# EAGLE design pcb (EAGLE 9.6.2)
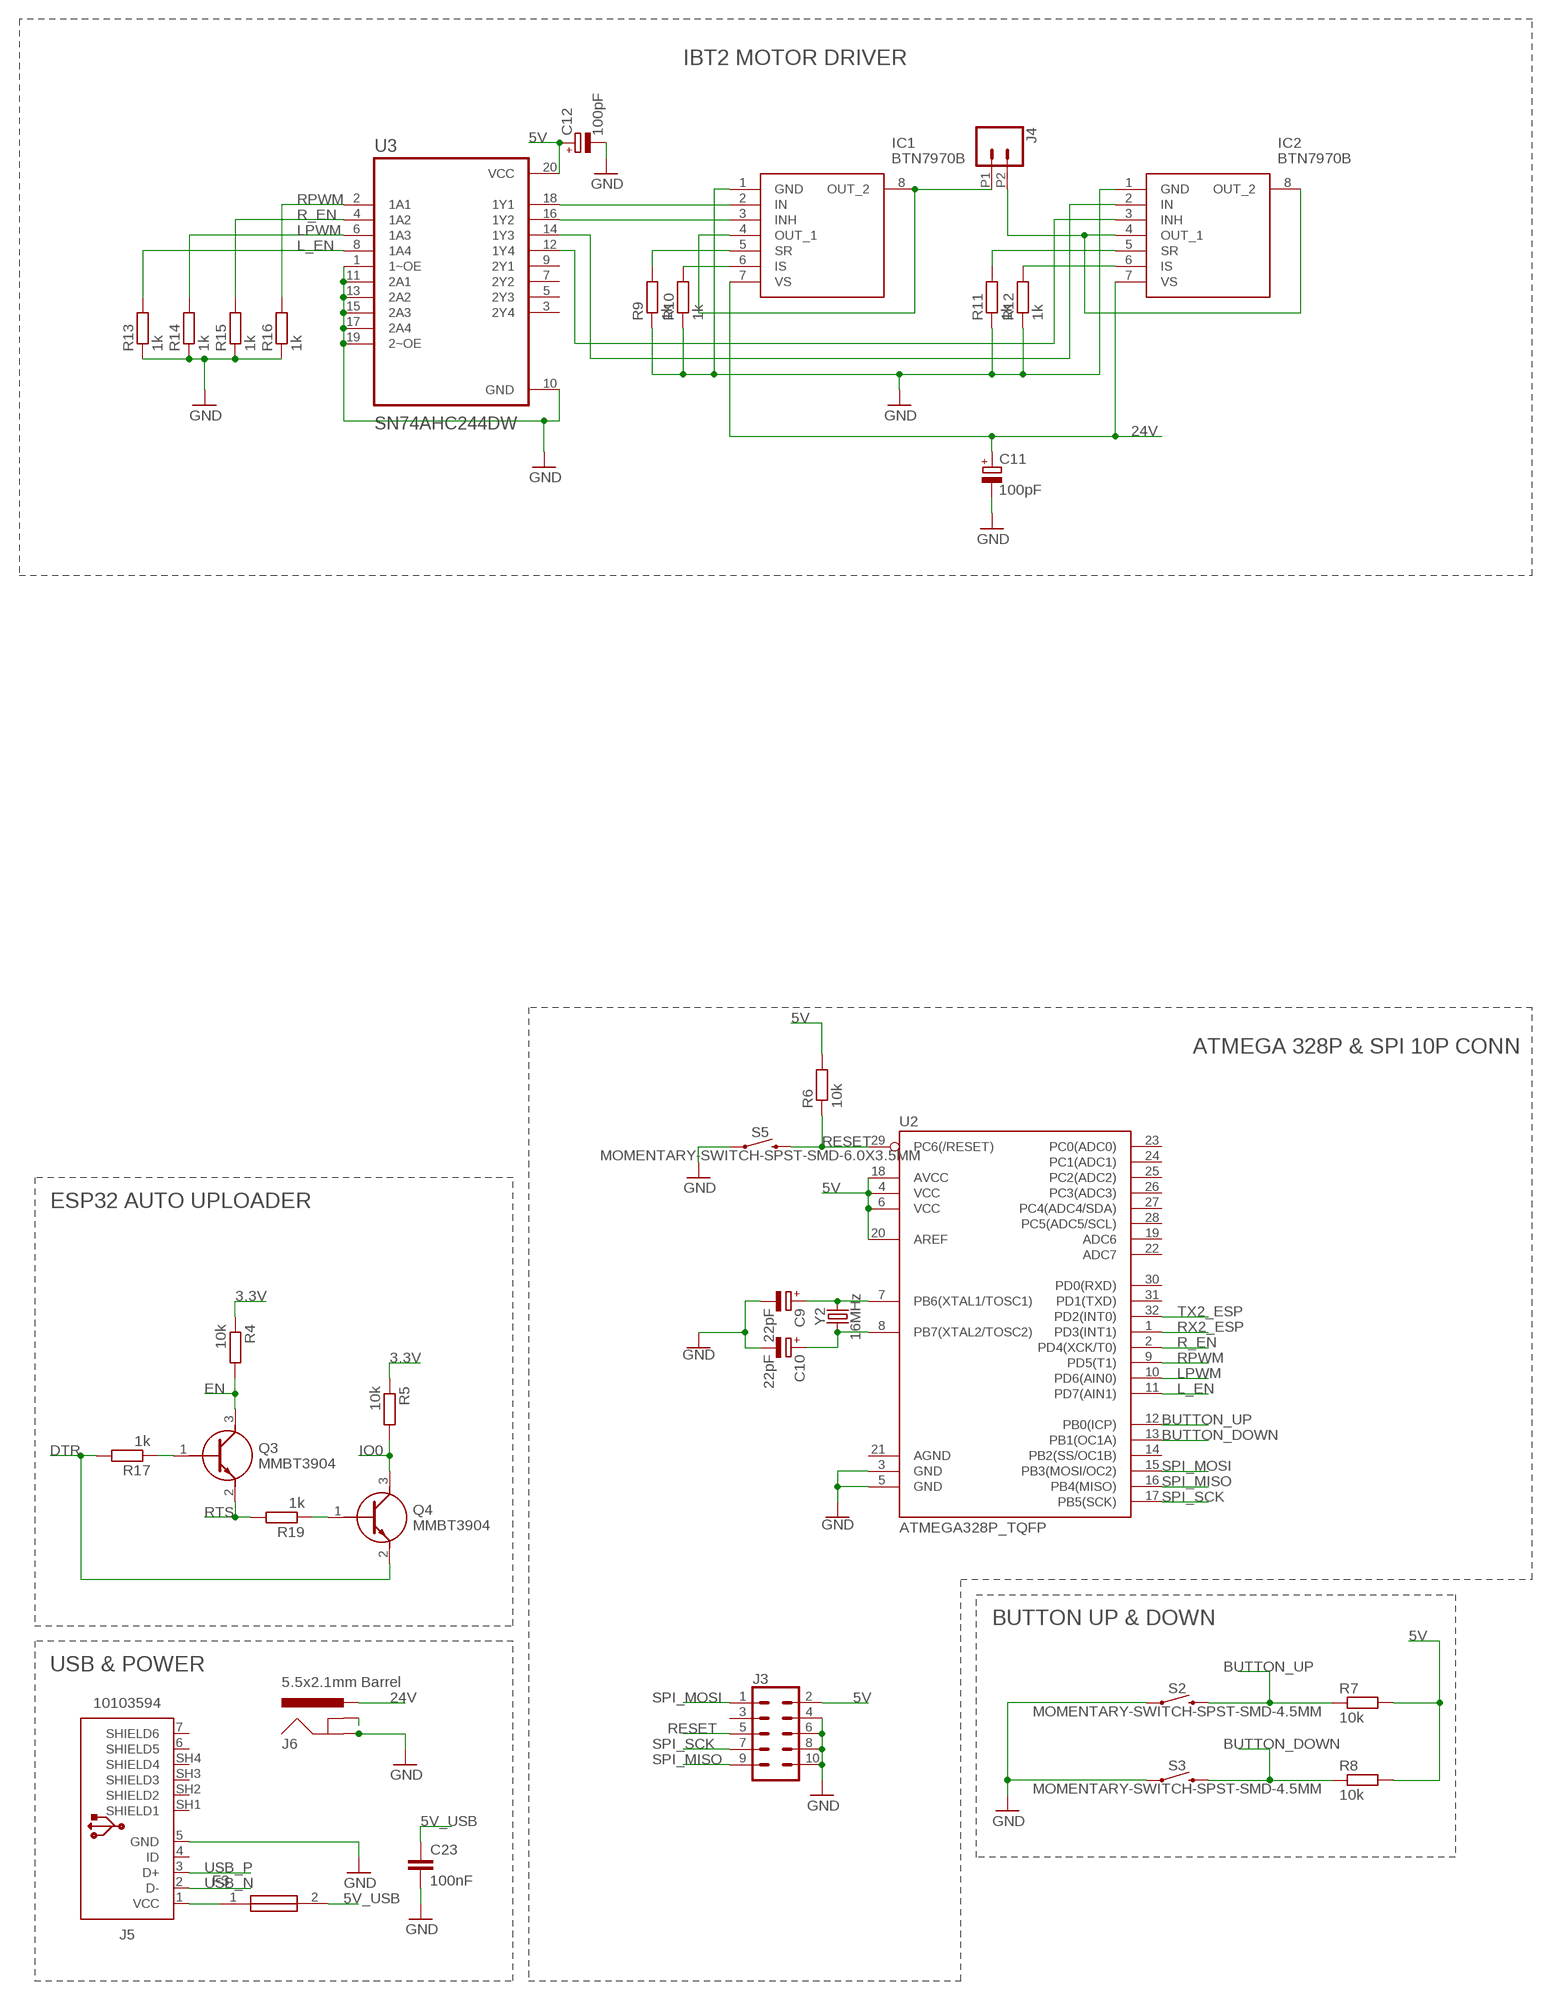
[diagram p0: schematic, sheet 1, part 1 of 2]
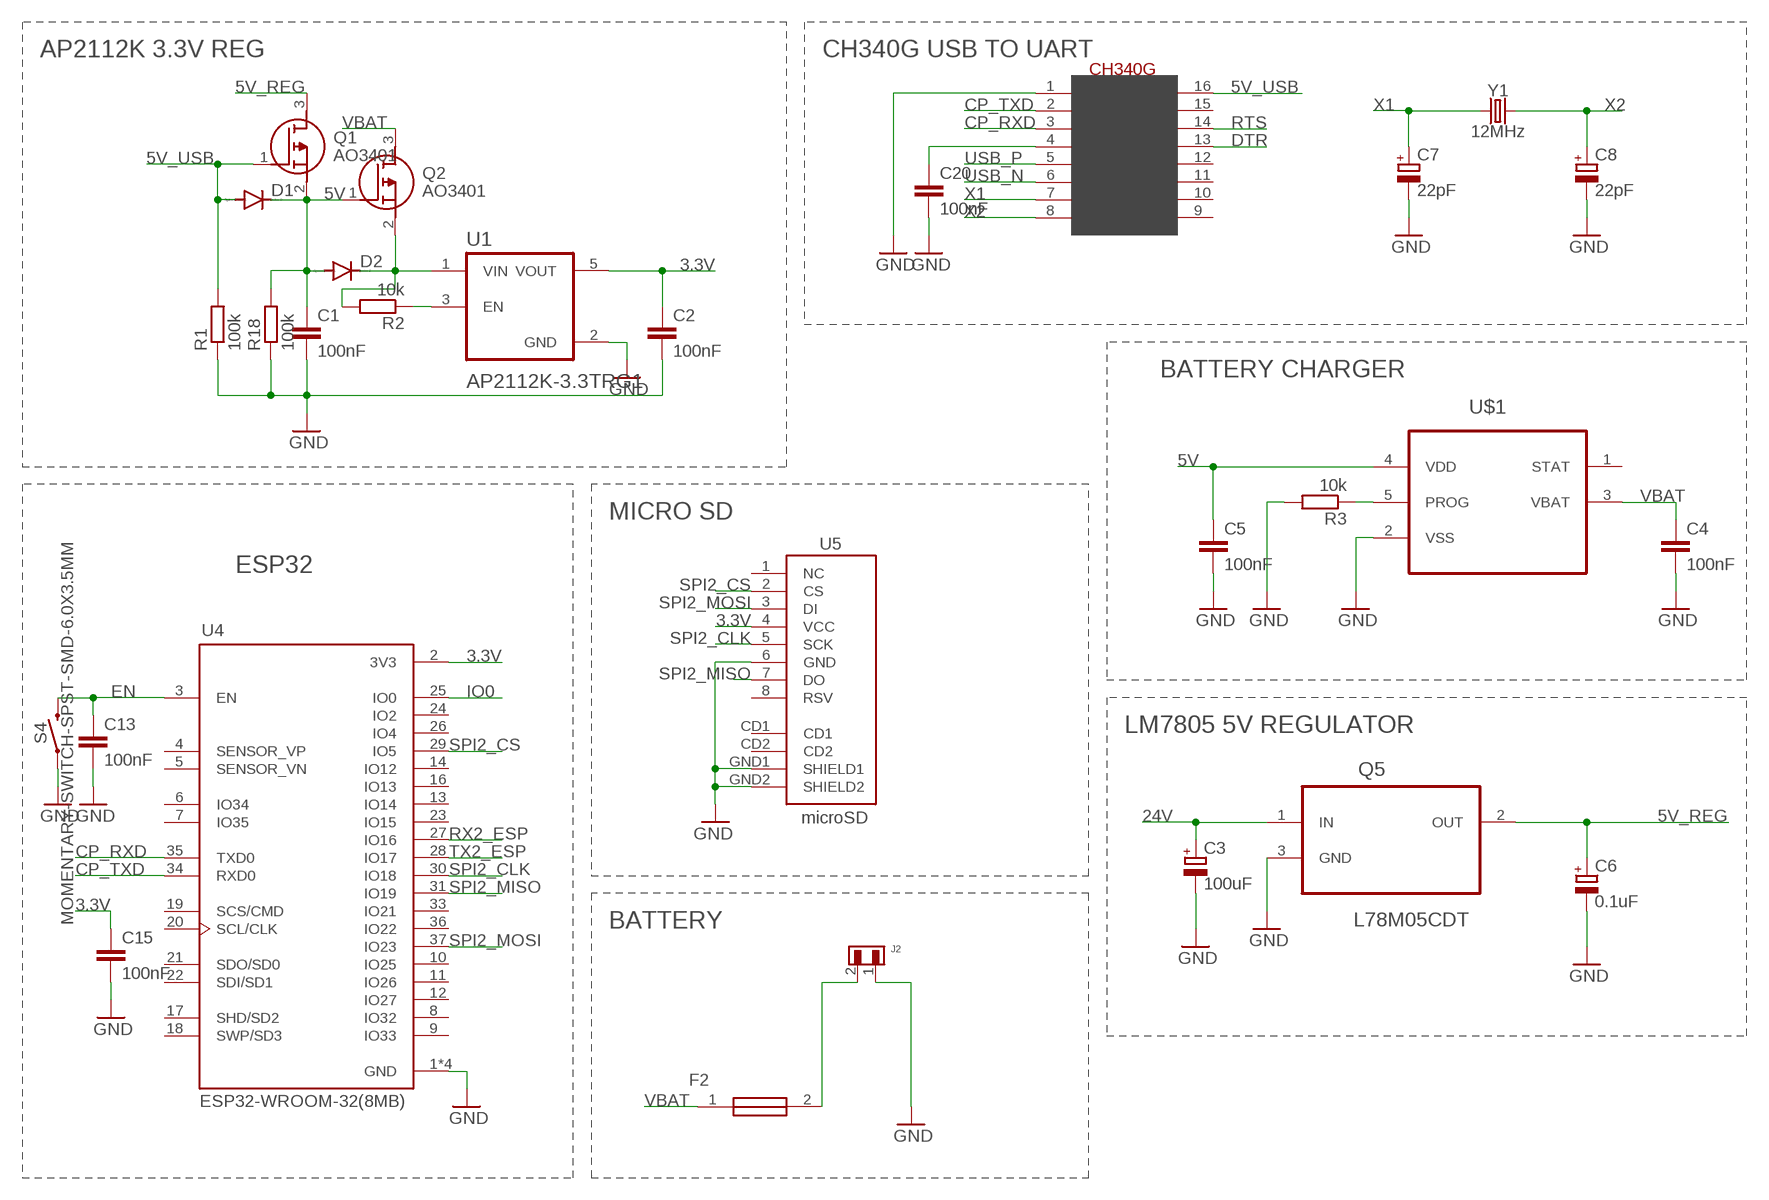
[diagram p1: schematic, sheet 1, part 2 of 2]

## Parts
C1  100nF  C-EUC0603  [C0603]
C2  100nF  C-EUC0603  [C0603]
C3  100uF  CPOL-EUSMCC  [SMC_C]
C4  100nF  C-EUC0603  [C0603]
C5  100nF  C-EUC0603  [C0603]
C6  0.1uF  CPOL-EUSMCC  [SMC_C]
C7  22pF  CPOL-EUSMCC  [SMC_C]
C8  22pF  CPOL-EUSMCC  [SMC_C]
C9  22pF  CPOL-EUSMCC  [SMC_C]
C10  22pF  CPOL-EUSMCC  [SMC_C]
C11  100pF  CPOL-EUSMCC  [SMC_C]
C12  100pF  CPOL-EUSMCC  [SMC_C]
C13  100nF  C-EUC0603  [C0603]
C15  100nF  C-EUC0603  [C0603]
C20  100nF  C-EUC0603  [C0603]
C23  100nF  C-EUC0603  [C0603]
D1  DIODE-DO214AC  [DO214AC]
D2  DIODE-DO214AC  [DO214AC]
F2  MF-NSML260_12-2  [FUSC3216X100N]
F3  MF-NSML260_12-2  [FUSC3216X100N]
IC1  BTN7970B  [PG-TO263-7-1]
IC2  BTN7970B  [PG-TO263-7-1]
J2  620102131822  [620102131822]
J3  CONN_05X2SHD-NS  [2X5-SHROUDED-NS]
J4  CONN_022.54MM_SCREWTERM  [1X02_2.54_SCREWTERM]
J5  10103594  [10103594]
J6  5.5x2.1mm Barrel  POWER_JACKSMD  [POWER_JACK_SMD]
Q1  AO3401  AO3401A  [SOT95P280X125-3N]
Q2  AO3401  AO3401A  [SOT95P280X125-3N]
Q3  MMBT3904  [SOT95P240X120-3N]
Q4  MMBT3904  [SOT95P240X120-3N]
Q5  L78M05CDT  [TO225P972X240-3N]
R1  100k  R-EU_R0603  [R0603]
R2  10k  R-EU_R0603  [R0603]
R3  10k  R-EU_R0603  [R0603]
R4  10k  R-EU_R0603  [R0603]
R5  10k  R-EU_R0603  [R0603]
R6  10k  R-EU_R0603  [R0603]
R7  10k  R-EU_R0603  [R0603]
R8  10k  R-EU_R0603  [R0603]
R9  1k  R-EU_R0603  [R0603]
R10  1k  R-EU_R0603  [R0603]
R11  1k  R-EU_R0603  [R0603]
R12  1k  R-EU_R0603  [R0603]
R13  1k  R-EU_R0603  [R0603]
R14  1k  R-EU_R0603  [R0603]
R15  1k  R-EU_R0603  [R0603]
R16  1k  R-EU_R0603  [R0603]
R17  1k  R-EU_R0603  [R0603]
R18  100k  R-EU_R0603  [R0603]
R19  1k  R-EU_R0603  [R0603]
S2  MOMENTARY-SWITCH-SPST-SMD-4.5MM  [TACTILE_SWITCH_SMD_4.5MM]
S3  MOMENTARY-SWITCH-SPST-SMD-4.5MM  [TACTILE_SWITCH_SMD_4.5MM]
S4  MOMENTARY-SWITCH-SPST-SMD-6.0X3.5MM  [TACTILE_SWITCH_SMD_6.0X3.5MM]
S5  MOMENTARY-SWITCH-SPST-SMD-6.0X3.5MM  [TACTILE_SWITCH_SMD_6.0X3.5MM]
U1  AP2112K-3.3TRG1  [SOT95P285X140-5N]
U2  ATMEGA328P_TQFP  [TQFP32-08]
U3  SN74AHC244DW  [SOIC127P1030X265-20N]
U4  ESP32-WROOM-32(8MB)  [MODULE_ESP32-WROOM-32(8MB)]
U5  microSD  USD-SOCKETSMD  [MICRO-SD-SOCKET-PP]
U$1  MCP73831T-5ACI/OT  [SOT95P280X145-5N]
U$2  CH340G  [SOIC16]
Y1  12MHz  CRYSTAL-12MHZ"  [CRYSTAL-SMD-5X3.2-4PAD]
Y2  16MHz  CRYSTAL-16MHZSMD-5X3.2  [CRYSTAL-SMD-5X3.2-4PAD]

## Nets
3.3V: C2.1 C15.1 R4.1 R5.1 U1.5(VOUT) U4.2(3V3) U5.4(VCC)
5V: C1.1 C5.1 C12.+ D1.C D2.A J3.2 Q1.2(S) Q2.1(G) R6.2 R7.2 R8.2 R18.2 U2.4(VCC) U2.6(VCC) U2.18(AVCC) U2.20(AREF) U3.20(VCC) U$1.4(VDD)
5V_REG: C6.+ Q1.3(D) Q5.2(OUT)
5V_USB: C23.1 D1.A F3.2 Q1.1(G) R1.2 U$2.16(VCC)
24V: C3.+ C11.+ IC1.7(VS) IC2.7(VS) J6.VIN0(PWR) Q5.1(IN)
BUTTON_DOWN: R8.1 S3.1 S3.4 U2.13(PB1(OC1A))
BUTTON_UP: R7.1 S2.1 S2.4 U2.12(PB0(ICP))
CP_RXD: U4.35(TXD0) U$2.3(RX)
CP_TXD: U4.34(RXD0) U$2.2(TX)
DTR: Q4.2(E) R17.2 U$2.13(DTR)
EN: C13.1 Q3.3(C) R4.2 S4.2 U4.3(EN)
GND: C1.2 C2.2 C3.- C4.2 C5.2 C6.- C7.- C8.- C9.- C10.- C11.- C12.- C13.2 C15.2 C20.2 C23.2 IC1.1(GND) IC2.1(GND) J2.1 J3.4 J3.6 J3.8 J3.10 J5.5(GND) J6.P$4(GND) Q5.3(GND) R1.1 R3.2 R9.1 R10.1 R11.1 R12.1 R13.1 R14.1 R15.1 R16.1 R18.1 S2.2 S2.3 S3.2 S3.3 S4.1 S5.1 U1.2(GND) U2.3(GND) U2.5(GND) U3.1(1~OE) U3.10(GND) U3.11(2A1) U3.13(2A2) U3.15(2A3) U3.17(2A4) U3.19(2~OE) U4.1(GND) U4.15(GND) U4.38(GND) U4.39(GND) U5.6(GND) U5.GND1(SHIELD1) U5.GND2(SHIELD2) U$1.2(VSS) U$2.1(GND)
IO0: Q4.3(C) R5.2 U4.25(IO0)
L_EN: R13.2 U2.11(PD7(AIN1)) U3.8(1A4)
LPWM: R14.2 U2.10(PD6(AIN0)) U3.6(1A3)
N$1: D2.C Q2.2(S) R2.2 U1.1(VIN)
N$2: IC1.4(OUT_1) IC1.8(OUT_2) J4.P1
N$3: C9.+ U2.7(PB6(XTAL1/TOSC1)) Y2.3
N$4: R2.1 U1.3(EN)
N$5: R3.1 U$1.5(PROG)
N$6: C10.+ U2.8(PB7(XTAL2/TOSC2)) Y2.1
N$7: IC2.4(OUT_1) IC2.8(OUT_2) J4.P2
N$8: IC1.5(SR) R9.2
N$9: IC1.2(IN) U3.18(1Y1)
N$10: IC1.3(INH) U3.16(1Y2)
N$11: IC1.6(IS) R10.2
N$12: IC2.2(IN) U3.14(1Y3)
N$13: IC2.3(INH) U3.12(1Y4)
N$14: IC2.5(SR) R11.2
N$15: C20.1 U$2.4(V3)
N$16: IC2.6(IS) R12.2
N$17: J6.GND(GNDBREAK)
N$18: F3.1 J5.1(VCC)
N$20: Q3.1(B) R17.1
N$23: Q4.1(B) R19.1
N$26: F2.2 J2.2
R_EN: R15.2 U2.2(PD4(XCK/T0)) U3.4(1A2)
RESET: J3.5 R6.1 S5.2 U2.29(PC6(/RESET))
RPWM: R16.2 U2.9(PD5(T1)) U3.2(1A1)
RTS: Q3.2(E) R19.2 U$2.14(RTS)
RX2_ESP: U2.1(PD3(INT1)) U4.27(IO16)
SPI2_CLK: U4.30(IO18) U5.5(SCK)
SPI2_CS: U4.29(IO5) U5.2(CS)
SPI2_MISO: U4.31(IO19) U5.7(DO)
SPI2_MOSI: U4.37(IO23) U5.3(DI)
SPI_MISO: J3.9 U2.16(PB4(MISO))
SPI_MOSI: J3.1 U2.15(PB3(MOSI/OC2))
SPI_SCK: J3.7 U2.17(PB5(SCK))
TX2_ESP: U2.32(PD2(INT0)) U4.28(IO17)
USB_N: J5.2(D-) U$2.6(D-)
USB_P: J5.3(D+) U$2.5(D+)
VBAT: C4.1 F2.1 Q2.3(D) U$1.3(VBAT)
X1: C7.+ U$2.7(XI) Y1.1
X2: C8.+ U$2.8(XO) Y1.3
Unconnected: J3.3 J5.4(ID) J5.6(SHIELD5) J5.7(SHIELD6) J5.SH1(SHIELD1) J5.SH2(SHIELD2) J5.SH3(SHIELD3) J5.SH4(SHIELD4) U2.14(PB2(SS/OC1B)) U2.19(ADC6) U2.21(AGND) U2.22(ADC7) U2.23(PC0(ADC0)) U2.24(PC1(ADC1)) U2.25(PC2(ADC2)) U2.26(PC3(ADC3)) U2.27(PC4(ADC4/SDA)) U2.28(PC5(ADC5/SCL)) U2.30(PD0(RXD)) U2.31(PD1(TXD)) U3.3(2Y4) U3.5(2Y3) U3.7(2Y2) U3.9(2Y1) U4.4(SENSOR_VP) U4.5(SENSOR_VN) U4.6(IO34) U4.7(IO35) U4.8(IO32) U4.9(IO33) U4.10(IO25) U4.11(IO26) U4.12(IO27) U4.13(IO14) U4.14(IO12) U4.16(IO13) U4.17(SHD/SD2) U4.18(SWP/SD3) U4.19(SCS/CMD) U4.20(SCL/CLK) U4.21(SDO/SD0) U4.22(SDI/SD1) U4.23(IO15) U4.24(IO2) U4.26(IO4) U4.33(IO21) U4.36(IO22) U5.1(NC) U5.8(RSV) U5.CD1 U5.CD2 U$1.1(STAT) U$2.9(CTS) U$2.10(DSR) U$2.11(RI) U$2.12(DCD) U$2.15(RS232)

## Notes on the sheet
- IBT2 MOTOR DRIVER
- ATMEGA 328P & SPI 10P CONN
- ESP32 AUTO UPLOADER
- BUTTON UP & DOWN
- USB & POWER
- AP2112K 3.3V REG | CH340G USB TO UART
- BATTERY CHARGER
- MICRO SD
- ESP32
- LM7805 5V REGULATOR
- BATTERY

## Library data of the parts
C1 C2 C4 C5 C13 C15 C20 C23 = rcl:C-EU: CAPACITOR, European symbol; SPICEPREFIX: C
C3 C6-C12 = rcl:CPOL-EU: POLARIZED CAPACITOR, European symbol; SPICEPREFIX: C
D1 D2 = diode:DIODE-: DIODE
F2 F3 = MF-NSML260_12-2:MF-NSML260_12-2: Resettable Fuses - PPTC 2.6A 12V 1206 LOW-OHMIC Source: Datasheet <https://www.bourns.com/docs/product-datasheets/mf-nsml-x.pdf>; ARROW_PART_NUMBER: MF-NSML260/12-2; ARROW_PRICE-STOCK: https://www.arrow.com/en/products/mf-nsml26012-2/bourns; DESCRIPTION: Resettable Fuses - PPTC 2.6A 12V 1206 LOW-OHMIC; HEIGHT: 1mm; MANUFACTURER_NAME: Bourns; MANUFACTURER_PART_NUMBER: MF-NSML260/12-2; MOUSER_PART_NUMBER: 652-MF-NSML260/12-2; MOUSER_PRICE-STOCK: https://www.mouser.com/Search/Refine.aspx?Keyword=652-MF-NSML260%2F12-2
IC1 IC2 = BTN7970B:BTN7970B: H-Bridge Motor Driver 40A Infineon BTN7970B, Half Bridge Motor Driver, High Current PN Half Bridge, 7-Pin TO-263 Source: Datasheet <https://www.infineon.com/dgdl/Infineon-BTN7970-DS-v01_01-en.pdf?fileId=db3a304316f66ee80117642373746a89>; DESCRIPTION: H-Bridge Motor Driver 40A Infineon BTN7970B, Half Bridge Motor Driver, High Current PN Half Bridge, 7-Pin TO-263; HEIGHT: mm; MANUFACTURER_NAME: Infineon; MANUFACTURER_PART_NUMBER: BTN7970B; MOUSER_PART_NUMBER: 726-BTN7970B; MOUSER_PRICE-STOCK: https://www.mouser.co.uk/ProductDetail/Infineon-Technologies/BTN7970B?qs=9Vqdt%252BdHmfIYJ324yelOtg%3D%3D
J2 = Wurth_Connectors_WR-WTB:620102131822: WR-WTB 2.00 mm SMT Male Horizontal Shrouded Header KIND PROPERTIES: Pitch:2 mm Gender:Male MATERIAL PROPERTIES: Insulator Material :PA9T Insulator Flammability Rating:UL94 V-0 Color:Beige Contact Material:Copper Alloy Contact Plating:Tin Contact Type:Stamped GENERAL INFORMATION Operating Temperature:-25 up to +85 °C Compliance: RoHS Working Voltage:100 V (AC) Withstanding Voltage:800V (AC) Contact Resistance:20 mΩ RISO:1000 MΩ CERTIFICATION UL Approval:E323964 PACKAGING PROPERTIES Packaging:Tape and Reel <https://katalog.we-online.com/media/images/v2/o33353v209%20Family_WR-WTB_6201xx131822.jpg> Details see: https://katalog.we-online.com/en/em/WTB_2_00_SMT_MALE_HORIZONTAL_SHROUDED_HEADER_6201XX131822 Updated by Yingchun,Shan 2019-11-08 2019 (C) Würth Elektronik; CONTACT-RESISTANCE: 20mOhm; DATASHEET-URL: https://www.we-online.com/catalog/datasheet/620102131822.pdf; GENDER: Male; IR: 2A; L: 8mm; MOUNT: SMT; PACKAGING: Tape and Reel; PART-NUMBER: 620102131822; PCB-CABLE-PANEL: PCB; PINS: 2; PITCH: 2mm; TOL-R: max.; TYPE: Horizontal; USE-WITH: WR-WTB 2.00 mm Female Terminal Housing; VALUE: 620102131822; WORKING-VOLTAGE: 100V(AC)
J3 = SparkFun-Connectors:CONN_05X2: Multi connection point. Often used as Generic Header-pin footprint for 0.1 inch spaced/style header connections For AVR SPI programming port, see special device with nice symbol: "AVR_SPI_PROG_5x2.dev" You can populate with any combo of single row headers, but if you'd like an exact match, check these: 2x5 AVR ICSP Male Header <https://www.sparkfun.com/products/778> (PRT-00778) 2x5 Pin Shrouded Header <https://www.sparkfun.com/products/8506> (PRT-08506) On any of the 0.1 inch spaced packages, you can populate with these: Break Away Headers - Straight <https://www.sparkfun.com/products/116> (PRT-00116) Break Away Male Headers - Right Angle <https://www.sparkfun.com/products/553> (PRT-00553) Female Headers <https://www.sparkfun.com/products/115> (PRT-00115) Break Away Headers - Machine Pin <https://www.sparkfun.com/products/117> (PRT-00117) Break Away Female Headers - Swiss Machine Pin <https://www.sparkfun.com/products/743> (PRT-00743) Special note: the shrouded connector mates well with our 5x2 ribbon cables: 2x5 Pin IDC Ribbon Cable <https://www.sparkfun.com/products/8535> (PRT-08535); PROD_ID: CONN-08671; SF_ID: PRT-08506
J4 = SparkFun-Connectors:CONN_02: Multi connection point. Often used as Generic Header-pin footprint for 0.1 inch spaced/style header connections On any of the 0.1 inch spaced packages, you can populate with these: Break Away Headers - Straight <https://www.sparkfun.com/products/116> (PRT-00116) Break Away Male Headers - Right Angle <https://www.sparkfun.com/products/553> (PRT-00553) Female Headers <https://www.sparkfun.com/products/115> (PRT-00115) Break Away Headers - Machine Pin <https://www.sparkfun.com/products/117> (PRT-00117) Break Away Female Headers - Swiss Machine Pin <https://www.sparkfun.com/products/743> (PRT-00743) For SCREWTERMINALS and SPRING TERMINALS visit here: Screw Terimnals on SparkFun.com <https://www.sparkfun.com/search/results?term=Screw+Terminals> (5mm/3.5mm/2.54mm spacing) This device is also useful as a general connection point to wire up your design to another part of your project. Our various solder wires solder well into these plated through hole pads. Hook-Up Wire - Assortment (Stranded, 22 AWG) <https://www.sparkfun.com/products/11375> (PRT-11375) Hook-Up Wire - Assortment (Solid Core, 22 AWG) <https://www.sparkfun.com/products/11367> (PRT-11367) View the entire wire category on our website here <https://www.sparkfun.com/categories/141> Special notes: Molex polarized connector foot print use with: PRT-08233 with associated crimp pins and housings. 2.54_SCREWTERM for use with PRT-10571. 3.5mm Screw Terminal footprints for PRT-08084 5mm Screw Terminal footprints for use with PRT-08432
J5 = Connector_USB:10103594: USB(2.0) Micro-B, RCPT, 5POS, SMD-THT-R/A Datasheet <https://cdn.amphenol-icc.com/media/wysiwyg/files/documentation/datasheet/inputoutput/io_usb_micro.pdf> Drawing <https://cdn.amphenol-icc.com/media/wysiwyg/files/drawing/10103594.pdf>; CATEGORY: Connectors; CONTACTS: 5; CURRENT-RATING: 1.8A; DESCRIPTION: CONN RCPT USB2.0 MICRO B SMD R/A; GENDER: Receptacle; MANUFACTURER: Amphenol ICC (FCI); MOUNT_TYPE: R/A; MPN: 10103594-0001LF; OPERATING_TEMPERATURE: -30°C ~ 80°C; PART_STATUS: ACTIVE; ROHS_COMPLIANT: COMPLIANT; SUB_CATEGORY: USB; TYPE: USB-micro B; VOLTAGE-RATING: 100VAC
J6 = SparkFun-Connectors:POWER_JACK: Power Jack Connector This is the standard 5.5mm barrel jack for power. The PTH is the most common, proven, reliable, footprint. The Slot footprint only works if the mill layer is transmitted to the PCB fab house so be warned. Here are the connectors we sell at SparkFun: DC Barrel Power Jack/Connector <https://www.sparkfun.com/products/119> (PRT-00119) DC Barrel Power Jack/Connector (SMD) <https://www.sparkfun.com/products/12748> (PRT-12748) DC Barrel Jack Adapter - Breadboard Compatible <https://www.sparkfun.com/products/10811> (PRT-10811) It is used on this SparkFun product (and many, many others): SparkFun RedBoard - Programmed with Arduino <https://www.sparkfun.com/products/12757> (DEV-12757) Also, if you need a mating power supply or connector, please check these out: Wall Adapter Power Supply - 9VDC 650mA <https://www.sparkfun.com/products/298> (TOL-00298) DC Barrel Jack Adapter - Male <https://www.sparkfun.com/products/10287> (PRT-10287); PROD_ID: CONN-08106; SF_ID: PRT-12748
Q1 Q2 = AO3401A:AO3401A: 30V P-Channel MOSFET Source: Datasheet <http://www.aosmd.com/pdfs/datasheet/AO3401A.pdf>; ARROW_PART_NUMBER: AO3401A; ARROW_PRICE-STOCK: https://www.arrow.com/en/products/ao3401a/alpha-and-omega-semiconductor; DESCRIPTION: 30V P-Channel MOSFET; HEIGHT: 1.25mm; MANUFACTURER_NAME: Alpha & Omega Semiconductors; MANUFACTURER_PART_NUMBER: AO3401A
Q3 Q4 = MMBT3904:MMBT3904: Transistor GP BJT NPN 40V 0.2A SOT23 Fairchild MMBT3904 NPN Bipolar Transistor, 0.2 A, 40 V, 3-Pin SOT-23 Source: Datasheet <https://media.digikey.com/pdf/Data Sheets/ON Semiconductor PDFs/2N3904,MMBT3904,PZT3904.pdf>; ARROW_PART_NUMBER: MMBT3904; ARROW_PRICE-STOCK: https://www.arrow.com/en/products/mmbt3904/on-semiconductor; DESCRIPTION: Transistor GP BJT NPN 40V 0.2A SOT23 Fairchild MMBT3904 NPN Bipolar Transistor, 0.2 A, 40 V, 3-Pin SOT-23; HEIGHT: 1.2mm; MANUFACTURER_NAME: ON Semiconductor; MANUFACTURER_PART_NUMBER: MMBT3904; MOUSER_PART_NUMBER: 512-MMBT3904; MOUSER_PRICE-STOCK: https://www.mouser.co.uk/ProductDetail/ON-Semiconductor-Fairchild/MMBT3904?qs=UMEuL5FsraCg3xKjS4uBJQ%3D%3D
Q5 = L78M05CDT:L78M05CDT: Positive voltage regulators Check prices <https://pricing.snapeda.com/parts/L78M05CDT/STMicroelectronics/view-part?ref=eda>; AVAILABILITY: In Stock; DESCRIPTION: 7805 based precision 5V fixed regulator with output current of up to 500mA and wide temperature operating range of 0°C to 150°C.; MF: STMicroelectronics; MP: L78M05CDT; PACKAGE: TO-252-3 STMicroelectronics; PRICE: None
R1-R19 = rcl:R-EU_: RESISTOR, European symbol; SPICEPREFIX: R
S2 S3 = SparkFun-Switches:MOMENTARY-SWITCH-SPST: Momentary Switch (Pushbutton) - SPST Normally-open (NO) SPST momentary switches (buttons, pushbuttons). Variants PTH-12MM - 12mm square, through-hole Momentary Pushbutton Switch - 12mm Square <https://www.sparkfun.com/products/9190> (COM-09190) PTH-6.0MM, PTH-6.0MM-KIT - 6.0mm square, through-hole Mini Pushbutton Switch <https://www.sparkfun.com/products/97> (COM-00097) KIT package intended for soldering kit's - only one side of pads' copper is exposed. PTH-RIGHT-ANGLE-KIT - Right-angle, through-hole Right Angle Tactile Button <https://www.sparkfun.com/products/10791> - Used on SparkFun BigTime Watch Kit <https://www.sparkfun.com/products/11734> SMD-12MM - 12mm square, surface-mount Tactile Button - SMD (12mm) <https://www.sparkfun.com/products/12993> (COM-12993) Used on SparkFun PicoBoard <https://www.sparkfun.com/products/11888> SMD-4.5MM - 4.5mm Square Trackball Switch Used on SparkFun Blackberry Trackballer Breakout <https://www.sparkfun.com/products/13169> SMD-4.6MMX2.8MM - 4.60mm x 2.80mm, surface mount Used on SparkFun SAMD21 Mini Breakout <https://www.sparkfun.com/products/13664> SMD-5.2MM, SMD-5.2-REDUNDANT - 5.2mm square, surface-mount Mini Pushbutton Switch - SMD <https://www.sparkfun.com/products/8720> (COM-08720) Used on Arduino Pro Mini <https://www.sparkfun.com/products/11114> REDUNDANT package connects both switch circuits together SMD-6.0X3.5MM - 6.0 x 3.5mm, surface mount Momentary Reset Switch SMD <https://www.sparkfun.com/products/8229> (COM-08229) SMD-6.2MM-TALL - 6.2mm square, surface mount Tactile Button - SMD (6mm) <https://www.sparkfun.com/products/12992> Used on SparkFun Digital Sandbox <https://www.sparkfun.com/products/12651> SMD-RIGHT-ANGLE - Right-angle, surface mount Used on SparkFun Block for Intel® Edison - Arduino <https://www.sparkfun.com/products/13036>; PROD_ID: SWCH-09213
S4 S5 = SparkFun-Switches:MOMENTARY-SWITCH-SPST: Momentary Switch (Pushbutton) - SPST Normally-open (NO) SPST momentary switches (buttons, pushbuttons). Variants PTH-12MM - 12mm square, through-hole Momentary Pushbutton Switch - 12mm Square <https://www.sparkfun.com/products/9190> (COM-09190) PTH-6.0MM, PTH-6.0MM-KIT - 6.0mm square, through-hole Mini Pushbutton Switch <https://www.sparkfun.com/products/97> (COM-00097) KIT package intended for soldering kit's - only one side of pads' copper is exposed. PTH-RIGHT-ANGLE-KIT - Right-angle, through-hole Right Angle Tactile Button <https://www.sparkfun.com/products/10791> - Used on SparkFun BigTime Watch Kit <https://www.sparkfun.com/products/11734> SMD-12MM - 12mm square, surface-mount Tactile Button - SMD (12mm) <https://www.sparkfun.com/products/12993> (COM-12993) Used on SparkFun PicoBoard <https://www.sparkfun.com/products/11888> SMD-4.5MM - 4.5mm Square Trackball Switch Used on SparkFun Blackberry Trackballer Breakout <https://www.sparkfun.com/products/13169> SMD-4.6MMX2.8MM - 4.60mm x 2.80mm, surface mount Used on SparkFun SAMD21 Mini Breakout <https://www.sparkfun.com/products/13664> SMD-5.2MM, SMD-5.2-REDUNDANT - 5.2mm square, surface-mount Mini Pushbutton Switch - SMD <https://www.sparkfun.com/products/8720> (COM-08720) Used on Arduino Pro Mini <https://www.sparkfun.com/products/11114> REDUNDANT package connects both switch circuits together SMD-6.0X3.5MM - 6.0 x 3.5mm, surface mount Momentary Reset Switch SMD <https://www.sparkfun.com/products/8229> (COM-08229) SMD-6.2MM-TALL - 6.2mm square, surface mount Tactile Button - SMD (6mm) <https://www.sparkfun.com/products/12992> Used on SparkFun Digital Sandbox <https://www.sparkfun.com/products/12651> SMD-RIGHT-ANGLE - Right-angle, surface mount Used on SparkFun Block for Intel® Edison - Arduino <https://www.sparkfun.com/products/13036>; PROD_ID: SWCH-00815; SF_SKU: COM-08229
U1 = AP2112K-3.3TRG1:AP2112K-3.3TRG1: AP2112 Series 0.6 A 3.3 V Fixed Output SMT LDO Linear Regulator - SOT23-5 Check prices <https://pricing.snapeda.com/parts/AP2112K-3.3TRG1/Diodes%20Inc./view-part?ref=eda>; AVAILABILITY: In Stock; DESCRIPTION: Linear Voltage Regulator IC Positive Fixed 1 Output 600mA SOT-25; MF: Diodes Inc.; MP: AP2112K-3.3TRG1; PACKAGE: SOT-753 Diodes Inc.; PRICE: None; PURCHASE-URL: https://pricing.snapeda.com/search/part/AP2112K-3.3TRG1/?ref=eda
U2 = SparkFun-IC-Microcontroller:ATMEGA328P_TQFP: Popular 328P in QFP Storefront component: ATmega328 - TQFP <https://www.sparkfun.com/products/13448> (COM-13448) Datasheet <http://www.sparkfun.com/datasheets/Components/SMD/ATMega328.pdf> SparkFun Products SparkFun RedBoard - Programmed with Arduino <https://www.sparkfun.com/products/12757> (DEV-12757) Arduino Pro Mini 328 - 5V/16MHz <https://www.sparkfun.com/products/11113> (DEV-11113) Arduino Pro Mini 328 - 3.3V/8MHz <https://www.sparkfun.com/products/11114> (DEV-11114) SparkFun OpenLog <https://www.sparkfun.com/products/13712> (DEV-13712) SparkFun MicroView - OLED Arduino Module <https://www.sparkfun.com/products/12923> (DEV-12923) SparkFun Digital Sandbox <https://www.sparkfun.com/products/12651> (DEV-12651) SparkFun PicoBoard <https://www.sparkfun.com/products/11888> (WIG-11888) Arduino Fio <https://www.sparkfun.com/products/10116> (DEV-10116) LilyPad Arduino 328 Main Board <https://www.sparkfun.com/products/13342> (DEV-13342) SparkFun RedStick <https://www.sparkfun.com/products/13741> (DEV-13741) LilyPad MP3 <https://www.sparkfun.com/products/11013> (DEV-11013) LilyPad Arduino SimpleSnap <https://www.sparkfun.com/products/10941> (DEV-10941) SparkFun Stepoko <https://www.sparkfun.com/products/13899> (ROB-13899) SparkFun Geiger Counter <https://www.sparkfun.com/products/11345> (SEN-11345) SparkFun EL Sequencer <https://www.sparkfun.com/products/12781> (COM-12781) Arduino Pro 328 - 5V/16MHz <https://www.sparkfun.com/products/10915> (DEV-10915) CryptoCape <https://www.sparkfun.com/products/12773> (DEV-12773) SparkFun IR Thermometer Evaluation Board - MLX90614 <https://www.sparkfun.com/products/10740> (SEN-10740) SparkFun RedBot Mainboard <https://www.sparkfun.com/products/12097> (ROB-12097) Arduino Pro 328 - 3.3V/8MHz <https://www.sparkfun.com/products/10914> (DEV-10914) SparkFun Block for Intel® Edison - Arduino <https://www.sparkfun.com/products/13036> (DEV-13036) SparkFun Simon Says - Surface Mount Soldering Kit <https://www.sparkfun.com/products/10935> (KIT-10935) SparkFun 7-Segment Serial Display - Red <https://www.sparkfun.com/products/11441> (COM-11441) SparkFun 7-Segment Serial Display - White <https://www.sparkfun.com/products/11629> (COM-11629) SparkFun 7-Segment Serial Display - Yellow <https://www.sparkfun.com/products/11443> (COM-11443) SparkFun 7-Segment Serial Display - Kelly Green <https://www.sparkfun.com/products/11440> (COM-11440) SparkFun 7-Segment Serial Display - Blue <https://www.sparkfun.com/products/11442> (COM-11442) SparkFun OpenSegment Serial Display - 20mm (Blue) <https://www.sparkfun.com/products/11647> (COM-11647) SparkFun OpenSegment Serial Display - 20mm (Green) <https://www.sparkfun.com/products/11646> (COM-11646) SparkFun OpenSegment Serial Display - 20mm (White) <https://www.sparkfun.com/products/11648> (COM-11648) SparkFun OpenSegment Serial Display - 20mm (Red) <https://www.sparkfun.com/products/11644> (COM-11644) SparkFun OpenSegment Serial Display - 20mm (Yellow) <https://www.sparkfun.com/products/11645> (COM-11645) SparkFun OpenSegment Shield <https://www.sparkfun.com/products/13190> (DEV-13190); PROD_ID: IC-09069
U3 = SN74AHC244DW:SN74AHC244DW: Check prices <https://pricing.snapeda.com/parts/SN74AHC244DW/Texas%20Instruments/view-part?ref=eda>; AVAILABILITY: In Stock; DESCRIPTION: Octal Buffers/Drivers With 3-State Outputs 20-SOIC -40 to 125; MF: Texas Instruments; MP: SN74AHC244DW; PACKAGE: SOIC-20 Texas Instruments; PRICE: None; PURCHASE-URL: https://pricing.snapeda.com/search/part/SN74AHC244DW/?ref=eda
U4 = ESP32-WROOM-32_8MB_:ESP32-WROOM-32(8MB): WIFI MODULE 64 MBITS SPI FLASH Check prices <https://pricing.snapeda.com/parts/ESP32-WROOM-32%20%288MB%29/Espressif%20Systems/view-part?ref=eda>; AVAILABILITY: Not in stock; DESCRIPTION: Bluetooth, WiFi 802.11b/g/n, Bluetooth v4.2 +EDR, Class 1, 2 and 3 Transceiver Module 2.4GHz ~ 2.5GHz Surface Mount; MF: Espressif Systems; MP: ESP32-WROOM-32 (8MB); PACKAGE: Module Espressif Systems; PRICE: None
U5 = SparkFun:USD-SOCKET: microSD Socket Push-push type uSD socket. Schematic element and footprint production proven. Spark Fun Electronics SKU : PRT-00127. tDoc lines correctly indicate media card edge positions when inserting (unlocked, locked, depressed).
U$1 = MCP73831T-5ACI_OT:MCP73831T-5ACI/OT: Charge Management Controller Check prices <https://pricing.snapeda.com/parts/MCP73831T-5ACI/OT/Microchip/view-part?ref=eda>; AVAILABILITY: Good; DESCRIPTION: Charger IC Lithium Ion/Polymer SOT-23-5; MF: Microchip; MP: MCP73831T-5ACI/OT; PACKAGE: SOT-23-5 Microchip; PRICE: None; PURCHASE-URL: https://pricing.snapeda.com/search/part/MCP73831T-5ACI/OT/?ref=eda
U$2 = usb-serial:CH340G
Y1 = SparkFun-Clocks:CRYSTAL-12MHZ: 12.0MHz Crystal Frequency: 12.0MHz Frequency Tolerance: ±20ppm Load Capacitance: 18pF SparkFun Products: SparkFun Logomatic <https://www.sparkfun.com/products/12772> Pocket AVR Programmer <https://www.sparkfun.com/products/9825>; PROD_ID: XTAL-08297
Y2 = SparkFun-Clocks:CRYSTAL-16MHZ: 16MHz Crystal Digikey Example <http://www.digikey.com/product-search/en?keywords=535-9122-1-ND> Frequency: 16MHz Frequency Stability: ±50ppm Frequency Tolerance: ±20ppm Load Capacitance: 18pF SparkFun Products: Pro Micro -5V/16MHz <https://www.sparkfun.com/products/12640> SparkFun Serial Enabled LCD Kit <https://www.sparkfun.com/products/10097>; PROD_ID: XTAL-08218; SF_ID: COM-00094

## Board
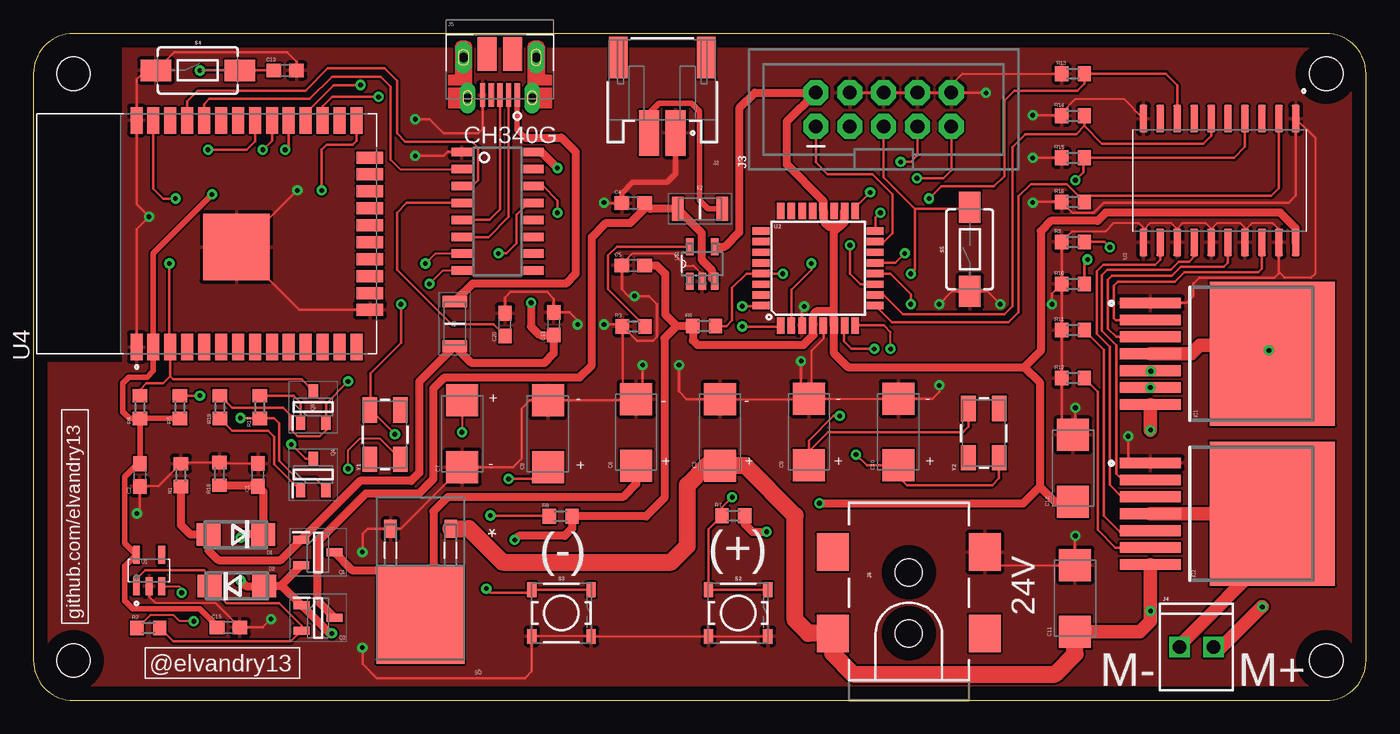
[diagram p2: board, top side]
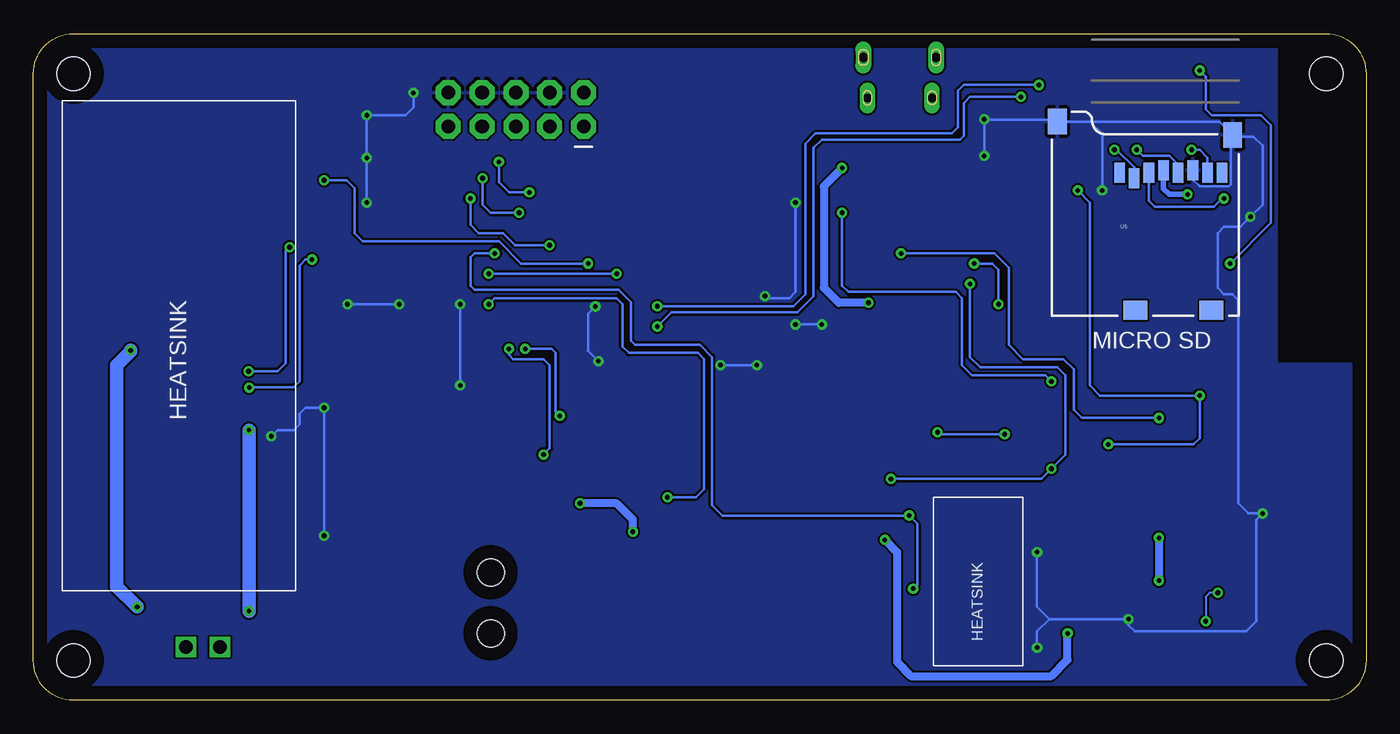
[diagram p3: board, bottom side, seen from below]

Size 100 x 50 mm. Coordinates in mm from the lower left corner, seen from the top.
Outline: 0,47 0,3 arc90 3,0 97,0 arc90 100,3 100,47 arc90 97,50 3,50 arc90 0,47
Copper layers (1+2*15+16): Top 0.035mm / dielectric 1.5mm / layer 2 0.035mm / dielectric 0.15mm / layer 15 0.035mm / dielectric 0.2mm / Bottom 0.035mm
Design rules "default *": minimum track width 6mil, minimum drill 0.35mm, track to track 6mil, track to pad 6mil, pad to pad 6mil, via to via 6mil, smd to smd 6mil, copper to edge 40mil, drill to drill 6mil, minimum pad ring 10mil, minimum via ring 8mil, stop-mask expansion 4mil, vias tented up to drill 25mil, thermal gap 10mil
Holes 2.5 mm at 3,3 3,47 97,47 97,3

### Footprints (pad centres in the part's own frame; a part is rotated, then mirrored left to right if it is on the bottom)
C0603 = smd 1.1 x 1: 1 -0.85,0; 2 0.85,0
SMC_C = smd 2.4 x 2.4: + -2.5,0; - 2.5,0
DO214AC = smd 1.8 x 1.7: A 2.05,0; C -2.05,0
FUSC3216X100N = smd 0.86 x 1.82: 1 -1.675,0; 2 1.675,0
PG-TO263-7-1 = smd 0.8 x 4.6: 1 -3.81,-12.2; 2 -2.54,-12.2; 3 -1.27,-12.2; 4 0,-12.2; 5 1.27,-12.2; 6 2.54,-12.2; 7 3.81,-12.2 | smd 10.8 x 9.4: 8 0,-3.05
620102131822 = smd 1.5 x 3.4: 1 -1,2.9; 2 1,2.9 | smd 1.4 x 3.1: Z1 -3.3,-2.75; Z2 3.3,-2.75
2X5-SHROUDED-NS = drill 1.016 pad 1.88 octagon: 1 -1.27,5.08; 2 1.27,5.08; 3 -1.27,2.54; 4 1.27,2.54; 5 -1.27,0; 6 1.27,0; 7 -1.27,-2.54; 8 1.27,-2.54; 9 -1.27,-5.08; 10 1.27,-5.08
1X02_2.54_SCREWTERM = drill 1.016 square: P1 2.54,0; P2 0,0
10103594 = smd 0.4 x 1.75: 1 -1.3,2.825; 2 -0.65,2.825; 3 0,2.825; 4 0.65,2.825; 5 1.3,2.825 | smd 1.425 x 2.5: 6 -0.963,-0.25; 7 0.963,-0.25 | drill 0.65 pad 0.73 long: SH1 -2.425,3.03; SH2 2.425,3.03 | drill 0.7 long: SH3 -2.725,0; SH4 2.725,0
POWER_JACK_SMD = smd 2.8 x 2.4: GND 0,-5.7; P$4 6.1,-5.7; VIN0 0,5.7; VIN1 6.1,5.7 | hole 2.032: 0,0; 4.572,0
SOT95P280X125-3N = smd 1.2 x 0.6: 1 -1.25,0.95; 2 -1.25,-0.95; 3 1.25,0
SOT95P240X120-3N = smd 1 x 0.7: 1 -1.2,0.95; 2 -1.2,-0.95; 3 1.2,0
TO225P972X240-3N = smd 0.94 x 1.321: 1 -2.261,-6.299; 3 2.261,-6.299 | smd 6.604 x 7.315: 2 0,0.152
R0603 = smd 1 x 1.1: 1 -0.85,0; 2 0.85,0
TACTILE_SWITCH_SMD_4.5MM = smd 0.7 x 1.1: 1 2.225,1.75; 2 2.225,-1.75; 3 -2.225,-1.75; 4 -2.225,1.75
TACTILE_SWITCH_SMD_6.0X3.5MM = smd 2.3 x 1.6: 1 -3.15,0; 2 3.15,0
SOT95P285X140-5N = smd 1.35 x 0.6: 1 -1.185,0.95; 2 -1.185,0; 3 -1.185,-0.95; 4 1.185,-0.95; 5 1.185,0.95
TQFP32-08 = smd 1.27 x 0.559: 1 -4.293,2.8; 2 -4.293,2; 3 -4.293,1.2; 4 -4.293,0.4; 5 -4.293,-0.4; 6 -4.293,-1.2; 7 -4.293,-2; 8 -4.293,-2.8; 17 4.293,-2.8; 18 4.293,-2; 19 4.293,-1.2; 20 4.293,-0.4; 21 4.293,0.4; 22 4.293,1.2; 23 4.293,2; 24 4.293,2.8 | smd 0.559 x 1.27: 9 -2.8,-4.293; 10 -2,-4.293; 11 -1.2,-4.293; 12 -0.4,-4.293; 13 0.4,-4.293; 14 1.2,-4.293; 15 2,-4.293; 16 2.8,-4.293; 25 2.8,4.293; 26 2,4.293; 27 1.2,4.293; 28 0.4,4.293; 29 -0.4,4.293; 30 -1.2,4.293; 31 -2,4.293; 32 -2.8,4.293
SOIC127P1030X265-20N = smd 2.06 x 0.6: 1 -4.64,5.715; 2 -4.64,4.445; 3 -4.64,3.175; 4 -4.64,1.905; 5 -4.64,0.635; 6 -4.64,-0.635; 7 -4.64,-1.905; 8 -4.64,-3.175; 9 -4.64,-4.445; 10 -4.64,-5.715; 11 4.64,-5.715; 12 4.64,-4.445; 13 4.64,-3.175; 14 4.64,-1.905; 15 4.64,-0.635; 16 4.64,0.635; 17 4.64,1.905; 18 4.64,3.175; 19 4.64,4.445; 20 4.64,5.715
MODULE_ESP32-WROOM-32(8MB) = smd 2 x 0.9: 1 -8.5,5.26; 2 -8.5,3.99; 3 -8.5,2.72; 4 -8.5,1.45; 5 -8.5,0.18; 6 -8.5,-1.09; 7 -8.5,-2.36; 8 -8.5,-3.63; 9 -8.5,-4.9; 10 -8.5,-6.17; 11 -8.5,-7.44; 12 -8.5,-8.71; 13 -8.5,-9.98; 14 -8.5,-11.25; 25 8.5,-11.25; 26 8.5,-9.98; 27 8.5,-8.71; 28 8.5,-7.44; 29 8.5,-6.17; 30 8.5,-4.9; 31 8.5,-3.63; 32 8.5,-2.36; 33 8.5,-1.09; 34 8.5,0.18; 35 8.5,1.45; 36 8.5,2.72; 37 8.5,3.99; 38 8.5,5.26 | smd 0.9 x 2: 15 -5.715,-12.25; 16 -4.445,-12.25; 17 -3.175,-12.25; 18 -1.905,-12.25; 19 -0.635,-12.25; 20 0.635,-12.25; 21 1.905,-12.25; 22 3.175,-12.25; 23 4.445,-12.25; 24 5.715,-12.25 | smd 5 x 5: 39 -1,-2.24
MICRO-SD-SOCKET-PP = smd 0.8 x 1.5: 1 -8.94,10.7; 2 -7.84,10.3; 3 -6.74,10.7; 4 -5.64,10.9; 5 -4.54,10.7; 6 -3.44,10.9; 7 -2.34,10.7; 8 -1.24,10.7 | smd 1.8 x 1.4: CD1 -7.75,0.4; CD2 -2.05,0.4 | smd 1.4 x 1.9: GND1 -13.6,14.55; GND2 -0.45,13.55
SOT95P280X145-5N = smd 1.27 x 0.559: 1 -1.295,0.94; 2 -1.295,0; 3 -1.295,-0.94; 4 1.295,-0.94; 5 1.295,0.94
SOIC16 = smd 0.635 x 1.524: 1 -4.445,-2.695; 2 -3.175,-2.695; 3 -1.905,-2.695; 4 -0.635,-2.695; 5 0.635,-2.695; 6 1.905,-2.695; 7 3.175,-2.695; 8 4.445,-2.695; 9 4.445,2.695; 10 3.175,2.695; 11 1.905,2.695; 12 0.635,2.695; 13 -0.635,2.695; 14 -1.905,2.695; 15 -3.175,2.695; 16 -4.445,2.695
CRYSTAL-SMD-5X3.2-4PAD = smd 1.9 x 1.1: 1 -1.85,-1.15; 2 1.85,-1.15; 3 1.85,1.15; 4 -1.85,1.15

### Placement (x,y rotation side)
C1  16.85,16.91 90 top
C2  8,16.9 270 top
C3  51.52,20.1 90 top
C4  45,37.3 180 top
C5  45,32.63 180 top
C6  45.22,20.1 90 top
C7  32.18,20 270 top
C8  38.61,20 90 top
C9  58.19,20.14 90 top
C10  64.89,20.14 90 top
C11  78.15,7.65 90 top
C12  78,17.41 90 top
C13  18.9,47.24 0 top
C15  14.65,5.47 0 top
C20  35.39,28.19 90 top
C23  39.05,28.25 90 top
D1  15.2,12.45 180 top
D2  15.27,8.58 0 top
F2  50.02,36.87 0 top
F3  31.62,28.25 270 top
IC1  96,26 270 top
IC2  96,14 270 top
J2  47.18,45.46 180 top
J3  63.79,44.32 90 top
J4  86,4 0 top
J5  35,48.22 180 top
J6  65.68,5.03 90 top
Q1  21.35,11.1 0 top
Q2  21.37,6.19 0 top
Q3  21,22 90 top
Q4  21,16.93 90 top
Q5  29.05,6.58 180 top
R1  11.07,16.9 270 top
R2  8.64,5.44 0 top
R3  45.05,28.05 180 top
R4  8,22 90 top
R5  11,22 90 top
R6  50.33,28.07 180 top
R7  52.52,13.85 0 top
R8  39.57,13.81 0 top
R9  78,34.39 0 top
R10  78,31.24 0 top
R11  78,27.78 0 top
R12  78,24.17 0 top
R13  78,47 0 top
R14  78,43.85 0 top
R15  78,40.7 0 top
R16  78,37.39 0 top
R17  17,22 270 top
R18  13.97,16.99 270 top
R19  14,22 90 top
S2  52.88,6.55 0 top
S3  39.62,6.55 0 top
S4  12.34,47.24 0 top
S5  70.26,33.83 90 top
U1  8.68,9.74 90 top
U2  58.87,32.41 90 top
U3  89,39 270 top
U4  13,35 90 top
U5  9.57,28.86 0 bottom
U$1  50.18,32.74 90 top
U$2  34.84,36.68 270 top
Y1  26.39,19.93 270 top
Y2  71.31,20.05 90 top

### Tracks (layer width: path | path; a pad name or v marks a point on that pad's centre or on a via)
3.3V  (via drill 0.35)
  Top 0.406: R4.1 C2.1 7.84,17.75 6.86,16.76 6.86,11.8 U1.5 6.86,10.05 6.86,7.47 7.47,6.86 12.5,6.86 13.8,5.56 C15.1 | R4.1 7.2,21.15 6.71,21.64 6.71,23.77 7.16,24.23 8.53,24.23 9.01,24.71 U4.2 9.01,33.55 v13.41,37.95 | R5.1 R4.1
  Bottom 0.406: U5.4 15.21,38.37 14.78,37.95 v13.41,37.95
5V  (via drill 0.35)
  Top 0.61: D2.A 17.25,8.64 | D2.A 18.68,8.58 Q2.1 22.23,5.03 v22.4,5.03 | Q1.2 18.53,8.58 D2.A | R18.2 16.77,16.14 C1.1 17.25,15.67 D1.C 15.65,12.45 15.54,12.34 v15.54,12.19 | 59.27,37.47 U2.20 | U2.20 59.34,36.64 59.34,35.88 59.71,35.51 60.5,35.51 60.87,35.88 U2.18 60.81,36.64 60.81,35.88 60.07,35.14 U2.6 | U2.4 58.53,28.18 | 58.53,28.18 58.53,28.95 58.8,29.21 59.74,29.21 60.01,28.95 60.01,28.18 U2.6 | R6.2 49.48,28.08 | R6.2 49.48,27.01 49.82,26.67 57.78,26.67 58.53,27.42 58.53,28.18 | 53.37,13.75 R7.2 53.37,13.24 53.96,12.65 v55.02,12.65 | C12.+ 76.63,14.91 75.51,16.02 | 74.37,24.99 61.11,24.99 60.07,26.03 U2.6 | R6.2 48.26,28.07 47.35,27.16 47.35,15.19 45.97,13.81 R8.2 40.42,12.9 39.87,12.34 36.42,12.34 v36.12,12.04 | v58.98,14.78 74.27,14.78 75.51,16.02 | U2.20 59.21,36.77 59.21,37.53 56.54,40.2 56.54,43.42 J3.2 54.14,45.59 52.95,44.4 52.95,35.1 51.88,34.04 U$1.4 | U3.20 94.72,35.43 93.57,36.58 80.47,36.58 79.86,35.97 76.35,35.97 75.59,35.2 75.59,26.21 74.37,24.99 | v15.54,8.99 15.96,8.58 D2.A | 74.37,24.99 75.51,23.85 75.51,16.02 | C5.1 46.77,32.63 47.4,32 47.4,28.96 48.28,28.07 R6.2
  Bottom 0.61: v55.02,12.65 55.02,13.56 56.24,14.78 v58.98,14.78 | v36.12,12.04 35.2,11.12 35.2,2.9 34.14,1.83 23.62,1.83 22.4,3.05 v22.4,5.03 | v15.54,12.19 v15.54,8.99
5V_REG
  Top 0.61: Q5.2 29.05,9.73 23.97,9.73 Q1.3 | C6.+ 45.22,16.23 44.23,15.24 31.09,15.24 30.02,14.17 30.02,7.4 Q5.2 | Q5.2 28.96,6.33 28.96,5.79
5V_USB  (via drill 0.35)
  Top 0.61: R1.2 11.07,13.16 11.78,12.45 D1.A 13.15,11.23 13.87,10.52 18.57,10.52 Q1.1 24.51,16.46 28.35,16.46 28.96,17.07 28.96,23.91 F3.2 32.89,25.3 38.32,25.3 39.05,26.02 C23.1 37.98,27.4 37.34,28.04 v37.34,29.82 | U$2.16 38.13,41.12 v39.32,39.93
  Bottom 0.61: v39.32,39.93 40.69,38.56 40.69,30.94 39.58,29.82 v37.34,29.82
24V  (via drill 0.35)
  Top 1.016: IC1.7 83.8,20.29 v83.82,20.27 | 78.76,5.15 83.02,5.15 83.82,5.94 v83.82,6.71 83.82,10.17 IC2.7 | 50.52,17.6 C3.+
  Top 1.27: Q5.1 32.69,12.88 35.2,10.36 47.85,10.36 49.07,11.58 49.07,16.15 50.52,17.6 | C3.+ 53.41,17.6 57.15,13.87 57.15,6.04 58.16,5.03 J6.VIN0 59.98,3.5 61.51,1.98 76.66,1.98 78.15,3.47 C11.+ 78.76,5.15
  Bottom 1.016: v83.82,20.27 v83.82,6.71
BUTTON_DOWN  (via drill 0.35)
  Top 0.203: S3.1 S3.4 37.17,8.08 34.29,8.08 v33.98,8.38 | R8.1 38.66,13.87 v34.29,13.87 | v65.38,33.53 64.66,32.81 U2.13
  Bottom 0.203: v65.38,33.53 66.9,33.53 67.21,33.22 67.21,31.09 66.9,30.79 56.08,30.79 55.17,29.87 55.17,26.98 54.86,26.67 49.99,26.67 49.07,25.76 49.07,14.63 48.31,13.87 v34.29,13.87 33.68,13.26 33.68,8.69 v33.98,8.38
BUTTON_UP  (via drill 0.35)
  Top 0.203: S2.1 S2.4 50.66,12.84 R7.1 51.67,14.49 v52.43,15.24 | v65.84,29.72 65.84,30.48 64.3,32.01 U2.12
  Bottom 0.203: v52.43,15.24 50.29,15.24 49.68,15.85 49.68,25.6 50.14,26.06 55.32,26.06 55.78,26.52 55.78,29.72 56.24,30.18 65.38,30.18 v65.84,29.72
CP_RXD
  Top 0.203: U$2.3 32.17,38.56 32.92,38.56 33.38,39.01 33.38,41.45 32.92,41.91 27.89,41.91 27.28,42.52 27.28,46.48 26.36,47.4 22.1,47.4 20.42,45.72 12.34,45.72 11.55,44.93 U4.35
CP_TXD
  Top 0.152: 32.08,39.85 27.51,39.85 26.82,40.54
  Top 0.203: U4.34 12.82,44.72 13.21,45.11 20.73,45.11 22.4,46.79 26.06,46.79 26.82,46.02 26.82,40.54 | 32.08,39.85 U$2.2
DTR  (via drill 0.35)
  Top 0.203: Q4.2 21.95,15.85 21.18,16.61 19.81,16.61 18.44,17.98 18.44,20.78 18.07,21.15 R17.2 15.58,21.15 v15.54,21.18 | v34.9,33.53 35.51,33.53 36.27,34.29 36.27,36.42 37.16,37.31 U$2.13
  Bottom 0.203: v34.9,33.53 27.89,33.53 26.82,32.46 26.82,26.67 25.76,25.6 22.71,25.6 21.95,24.84 21.95,21.79 21.34,21.18 v15.54,21.18
EN  (via drill 0.35)
  Top 0.203: R4.2 8,23.31 8.47,23.77 9.75,23.77 10.28,24.3 | Q3.3 20.12,24.08 10.5,24.08 10.28,24.3 | 10.28,24.3 U4.3 10.21,26.57 v10.21,32.77 | C13.1 S4.2 v12.5,47.24
  Bottom 0.203: v12.5,47.24 12.04,46.79 12.04,44.35 11.58,43.89 7.92,43.89 7.16,43.13 7.16,35.81 v10.21,32.77
GND  (via drill 0.35)
  Top 0.152: C3.- 58.16,22.6 C9.- 58.37,22.64 | 58.37,22.64 C10.- | 45.12,22.5 C6.- 44.2,23.63 R3.2 | S3.3 S3.2 S2.3 S2.2 | J6.P$4 72.37,10.15 C11.- | R13.1 69.71,47 68.87,46.16 J3.10 | C1.2 14.05,17.76 R18.1 11.17,17.84 R1.1 9.37,16.05 C2.2 | U1.2 8.68,7.78 9.14,7.32 13.66,7.32 C15.2 | U3.1 96.16,42.19 96.16,32 95.86,31.7 93.88,31.7 93.44,32.13 U3.19 93.44,35.33 92.96,35.81 91.44,35.81 90.91,35.28 U3.17 90.98,34.44 90.98,35.36 90.53,35.81 88.85,35.81 88.36,35.33 U3.15 88.39,34.39 88.39,35.36 87.94,35.81 86.26,35.81 85.83,35.38 U3.13 85.83,35.33 85.34,35.81 83.82,35.81 83.28,35.28 U3.11 83.36,34.44 83.36,35.36 82.91,35.81 81.08,35.81 80.47,35.2 77.96,35.2 R9.1 | R14.1 77.15,44.08 78.18,45.11 81.81,45.11 U3.10 | R10.1 | 77.15,20.76 77.91,20 C12.- | 44.15,37.75 C4.2 | C5.2 44.15,32.72 44.96,33.53 48.01,33.53 48.92,32.61 49.53,32.61 50.18,31.96 U$1.2 | U2.5 59.27,27.11 58.37,26.21 58.37,22.64
  Top 0.203: J3.4 J3.6 J3.8 J3.10 71.45,45.59 v71.48,45.57 | U4.39 19.95,29.29 U4.15 | v19.81,38.25 15.56,34 | 45.12,22.5 C8.- 37.24,22.5 36.63,21.89 36.63,18.14 35.99,17.5 C7.- 27.55,12.88 Q5.3 25.07,12.88 24.69,12.5 v24.69,11.12 | R9.1 R10.1 76.43,30.52 v76.43,29.72 | R10.1 R11.1 R12.1 77.15,20.76 | 15.67,5.64 C15.2 17.21,5.47 v17.83,6.1 | C20.2 35.39,30.21 35.81,30.63 38.56,30.63 39.05,30.14 C23.2 40.25,29.1 40.84,28.5 v40.84,28.19 | v42.82,28.19 44.06,28.19 R3.2 45.28,26.98 46.48,26.98 46.79,27.28 46.79,29.72 46.18,30.33 v45.11,30.33 44.65,30.33 44.15,30.83 44.15,32.72 | C4.2 42.86,37.3 v42.82,37.34 | C6.- 45.72,23.11 v45.72,25.15 | v48.44,25.15 48.44,23.19 49.02,22.6 C3.- | 68.03,29.78 v67.97,29.72 68.94,30.68 S5.1 71.58,30.68 v72.54,29.72 72.48,29.78 | v67.97,23.62 67.97,23.16 67.44,22.64 C10.- | U3.11 83.36,34.28 | J5.5 33.7,42.84 33.38,42.52 30.79,42.52 29.72,43.59 v28.65,43.59 | v28.65,40.84 30.79,40.84 31.09,41.15 32.12,41.15 U$2.1 | v7.77,14.02 8,14.25 C2.2 | 78.33,20.24 C12.- | C11.- 78.15,12.32 v78.18,12.34 | IC1.1 86.5,29.81 87.02,30.33 87.02,31.24 87.48,31.7 93.12,31.7 93.44,32.03 U3.19 | v74.98,43.89 77.11,43.89 R14.1 | v74.98,40.69 v74.98,40.7 R15.1 | v74.98,37.34 75.03,37.39 R16.1 77.96,36.58 79.55,36.58 80.31,37.34 94.18,37.34 94.72,37.87 U3.1 | U4.1 7.74,35.32 v8.69,36.27 7.74,37.22 U4.38 7.74,46.6 8.38,47.24 S4.1 10.57,48.62 19.05,48.62 19.75,47.92 C13.2 | U2.3 57.67,29.32 57.91,29.57 57.86,29.57 v57.84,29.54 | v57.61,25.45 57.61,23.4 58.37,22.64 | S3.3 37.4,2.19 36.88,1.68 25.76,1.68 24.69,2.74 v24.69,3.96 | v78.18,21.95 78.18,20.27 77.91,20 | v82.14,19.81 82.14,18.14 82.47,17.81 IC2.1
  Top 0.406: 15.56,34 U4.39 | J2.1 48.18,39.5 47.55,38.86 44.96,38.86 44.15,38.05 C4.2
  Bottom 0.203: 10.14,42.29 U5.GND2 11.02,43.41 U5.GND1 | 10.14,42.29 10.15,42.28 10.15,38.71 10.3,38.56 11.73,38.56 12.5,38.56 13.01,39.07 U5.6 | U5.GND1 20.73,43.41 19.81,42.5 v19.81,38.25 | v24.69,11.12 24.69,7.01 23.77,6.1 | 23.77,6.1 v17.83,6.1 17.83,5.64 17.37,5.18 8.99,5.18 8.23,5.94 8.23,13.56 v7.77,14.02 8.84,14.02 9.6,14.78 9.6,30.02 10.06,30.48 10.67,30.48 11.12,30.94 11.12,35.05 10.67,35.51 9.45,35.51 v8.69,36.27 7.77,37.19 7.77,41.6 8.46,42.29 10.14,42.29 | v40.84,28.19 v42.82,28.19 | v42.82,37.34 42.82,30.63 43.28,30.18 44.96,30.18 v45.11,30.33 | v45.72,25.15 v48.44,25.15 48.46,25.15 | v67.97,29.72 v67.97,23.62 | v72.54,29.72 v76.43,29.72 | v28.65,40.84 v28.65,43.59 28.63,43.57 23.32,43.57 U5.GND1 | v78.18,12.34 v78.18,21.95 79.55,21.95 80.01,21.49 80.01,20.73 80.47,20.27 81.69,20.27 v82.14,19.81 | v71.48,45.57 71.48,44.5 72.08,43.89 v74.98,43.89 v74.98,40.69 v74.98,37.34 | v57.84,29.54 58.37,29.01 58.37,26.21 v57.61,25.45 | v24.69,3.96 24.69,5.18 23.77,6.1
  pour Top: 0,0 99.97,0 99.97,5.03 99.97,49.99 94.34,49.99 6.71,49.99 6.71,25.3 0,25.3
  pour Bottom: 0,0 99.97,0 99.97,1.07 99.97,49.99 97.69,49.99 6.71,49.99 6.71,47.24 6.71,25.3 5.03,25.3 0,25.3
IO0  (via drill 0.35)
  Top 0.203: R5.2 12.49,22.85 v12.5,22.86 | v19.36,19.2 20.42,18.13 Q4.3 | v21.64,38.25 21.64,41.3 22.01,41.67 23.95,41.67 24.25,41.98 U4.25
  Bottom 0.203: v19.36,19.2 12.95,19.2 12.5,19.66 v12.5,22.86 19.96,22.86 20.73,23.62 20.73,37.34 v21.64,38.25
L_EN  (via drill 0.35)
  Top 0.203: U3.8 85.83,46.15 84.98,47 R13.2 78.85,46.24 78.33,45.72 73.61,45.72 72.85,44.96 72.85,39.32 72.08,38.56 68.12,38.56 v67.21,37.64 | v61.27,34.14 61.27,32 62.06,31.21 U2.11
  Bottom 0.203: v67.21,37.64 67.21,35.66 66.6,35.05 64.77,35.05 63.86,34.14 v61.27,34.14
LPWM
  Top 0.203: U3.6 88.36,42.34 87.78,41.76 80.18,41.76 78.85,43.09 | R14.2 78.85,43.09 | 78.85,43.09 78.24,42.48 74.43,42.48 73.46,41.5 73.46,29.57 72.85,28.96 65.23,28.96 63.77,30.41 U2.10
N$1
  Top 0.203: U1.1 7.73,9.11 8.38,9.75 12.8,9.75 13.22,9.34 D2.C 14.5,7.29 18.44,7.29 20.12,5.61 Q2.2 19.3,4.42 10.5,4.42 R2.2
N$2  (via drill 0.35)
  Top 1.016: IC1.8 v92.7,26.25 92.31,26.64 87.5,26.64 86.86,26 IC1.4 | v92.2,7.01 92.16,7.01 89.15,4 J4.P1
  Bottom 1.016: v92.7,26.25 92.7,26.17 93.73,25.15 93.73,8.53 v92.2,7.01
N$3  (via drill 0.35)
  Top 0.203: Y2.3 70.16,20.53 69.75,20.12 59.61,20.12 58.19,18.7 C9.+ 58.19,19.48 60.05,21.34 v60.5,21.34 | U2.7 60.83,28.08 60.83,26.92 61.39,26.36 v63.09,26.36
  Bottom 0.203: v63.09,26.36 61.11,26.36 60.81,26.06 60.81,21.64 v60.5,21.34
N$4  (via drill 0.35)
  Top 0.152: U1.3 10.95,8.55 11.12,8.38 v11.12,8.08 | v12.04,5.94 10.97,5.94 10.52,6.4 8.75,6.4 R2.1
  Top 0.203: R2.1 7.79,5.75
  Bottom 0.152: v11.12,8.08 11.73,8.08 12.04,7.77 v12.04,5.94
N$5
  Top 0.203: R3.1 43.13,30.82 43.13,33.38 43.79,34.04 U$1.5
N$6  (via drill 0.35)
  Top 0.152: v64.31,26.36 64.31,27.61 63.8,28.12
  Top 0.203: Y2.1 72.46,16.68 71.94,16.15 65.53,16.15 64.89,16.8 C10.+ 62.53,17.64 v61.72,18.44 | 63.8,28.12 U2.8
  Bottom 0.203: v61.72,18.44 61.27,18.9 61.27,25.15 61.72,25.6 64.01,25.6 64.31,25.91 v64.31,26.36
N$7
  Top 0.203: J4.P2 86.15,4 | 92.95,10.8 92.95,12.5 92.95,13.41 IC2.8
  Top 1.016: IC2.4 92.36,14 92.95,13.41 | J4.P2 86,4.15 92.95,11.1 92.95,12.5
N$8  (via drill 0.35)
  Top 0.203: v83.84,24.69 IC1.5 | 78.95,34.29 R9.2 80.37,34.39 v80.77,33.98
  Bottom 0.203: v80.77,33.98 81.08,33.68 81.08,25.3 81.69,24.69 v83.84,24.69
N$9
  Top 0.203: U3.18 92.17,32.38 91.91,32.11 86.37,32.11 85.65,31.39 81.38,31.39 81.08,31.09 81.08,28.65 81.23,28.5 83.76,28.5 IC1.2
N$10
  Top 0.203: IC1.3 81.24,27.27 80.62,27.89 80.62,31.55 80.92,31.85 85.4,31.85 86.08,32.53 89.33,32.53 89.64,32.84 U3.16
N$11  (via drill 0.35)
  Top 0.203: v79.1,33.07 78.85,32.83 R10.2
  Bottom 0.203: v79.1,33.07 79.55,33.07 80.01,32.61 80.01,23.93 80.47,23.47 83.82,23.47 IC1.6
  other vias: 83.8,23.46
N$12
  Top 0.203: 87.09,34.06 U3.14 87.09,33.3 86.72,32.92 85.95,32.92 85.34,32.31 80.57,32.31 80.16,31.9 80.16,27.74 81.25,26.65 81.25,17 81.79,16.46 83.72,16.46 IC2.2
N$13
  Top 0.203: U3.12 84.56,33.04 84.18,32.66 80.27,32.66 79.81,32.2 79.81,27.48 80.76,26.53 80.76,16.16 81.69,15.24 83.77,15.24 IC2.3
N$14
  Top 0.203: R11.2 80.31,26.32 80.31,13.87 81.53,12.65 83.72,12.65 IC2.5
N$15
  Top 0.203: U$2.4 28.02,37.31 27.28,36.58 27.28,32.31 31.39,28.19 34.54,28.19 C20.1
N$16
  Top 0.203: R12.2 79.86,23.16 79.86,12.8 81.2,11.46 IC2.6
N$18
  Top 0.406: J5.1 36.3,42.8 36.88,42.22
  Top 0.61: 36.88,42.22 39.62,42.22 40.69,41.15 40.69,32 39.95,31.27 32.96,31.27 F3.1
N$20
  Top 0.203: R17.1 19.52,22.85 20.05,22.32 Q3.1
N$23
  Top 0.203: R19.1 14.91,20.24 17.62,20.24 18.07,19.79 18.07,17.72 Q4.1
N$26
  Top 0.406: F2.2 50.63,36.87 49.99,37.51 49.99,44.2 49.38,44.81 46.94,44.81 46.18,44.05 J2.2
R_EN  (via drill 0.35)
  Top 0.203: U3.4 90.91,41.51 90.09,40.7 R15.2 78.79,40.64 78.79,39.62 v78.18,39.01 | U2.2 56.87,30.81 58.37,32.31 v58.37,32.77
  Bottom 0.203: v78.18,39.01 76.5,39.01 75.89,38.41 75.89,35.05 75.29,34.44 65.08,34.44 63.4,32.77 v58.37,32.77
RESET  (via drill 0.35)
  Top 0.203: R6.1 52,28.07 52.43,28.5 52.43,30.94 53.5,32.01 U2.29 56.23,32.01 v56.24,32 | 66.14,36.88 63.79,39.23 J3.5 | 66.14,36.88 70.15,36.88 S5.2 | v65.84,32 66.14,32.31 66.14,36.88
  Bottom 0.203: v56.24,32 v65.84,32
RPWM
  Top 0.203: U3.2 93.44,38.43 92.86,37.85 79.31,37.85 R16.2 77.53,38.71 74.83,38.71 73.91,37.8 73.91,29.11 73.15,28.35 64.43,28.35 U2.9
RTS  (via drill 0.35)
  Top 0.203: R19.2 14.9,21.95 18.75,21.95 19.29,21.4 19.29,20.35 19.83,19.81 21.49,19.81 21.95,20.27 Q3.2 21.95,22.25 v23.62,23.93 | v39.32,36.58 39.32,37.49 38.23,38.58 U$2.14
  Bottom 0.203: v39.32,36.58 39.32,31.09 38.86,30.63 30.79,30.63 30.33,30.18 30.33,25.15 29.57,24.38 24.08,24.38 v23.62,23.93
RX2_ESP  (via drill 0.35)
  Top 0.203: U2.1 55.99,28.04 v53.19,28.04 | v25.91,45.26 22.4,45.26 21.71,44.57 U4.27
  Bottom 0.203: v53.19,28.04 52.12,29.11 42.67,29.11 41.45,30.33 41.45,41.45 40.84,42.06 30.48,42.06 30.18,42.37 30.18,44.81 29.72,45.26 v25.91,45.26
SPI2_CLK  (via drill 0.35)
  Top 0.203: U4.30 17.9,41.98 v17.22,41.3
  Bottom 0.203: v17.22,41.3 16.76,40.84 14.78,40.84 14.11,40.17 U5.5
SPI2_CS  (via drill 0.35)
  Top 0.203: U4.29 19.17,41.57 v18.9,41.3
  Bottom 0.203: v18.9,41.3 18.73,41.3 17.41,39.97 U5.2
SPI2_MISO  (via drill 0.35)
  Top 0.203: U4.31 16.63,41.93 16,41.3 v13.11,41.3
  Bottom 0.203: v13.11,41.3 12.5,41.3 11.91,40.71 U5.7
SPI2_MOSI  (via drill 0.35)
  Top 0.203: U4.37 9.01,38.39 9.75,37.64 v10.67,37.64
  Bottom 0.203: v10.67,37.64 10.82,37.64 11.43,37.03 15.85,37.03 16.31,37.49 U5.3
SPI_MISO  (via drill 0.35)
  Top 0.203: J3.9 68.87,39.76 68.28,39.17 v66.29,39.17 | v63.55,36.58 63.16,36.19 U2.16
  Bottom 0.203: v66.29,39.17 66.29,37.19 65.68,36.58 v63.55,36.58
SPI_MOSI
  Top 0.203: U2.15 63.2,34.38 63.79,34.38 64.47,35.05 64.47,37.95 62.94,39.47 59.59,39.47 58.71,40.35 J3.1
SPI_SCK  (via drill 0.35)
  Top 0.203: J3.7 66.33,40.88 65.84,40.39 v65.08,40.39 | v62.79,38.1 61.67,36.98 U2.17
  Bottom 0.203: v65.08,40.39 65.08,38.86 64.31,38.1 v62.79,38.1
TX2_ESP  (via drill 0.35)
  Top 0.203: U2.32 54.53,29.57 v53.19,29.57 | U4.28 20.42,43.52 20.42,44.04 22.53,46.16 v24.56,46.16
  Bottom 0.203: v53.19,29.57 42.98,29.57 42.06,30.48 42.06,41.76 41.3,42.52 31.09,42.52 30.63,42.98 30.63,45.72 30.18,46.18 24.56,46.18 v24.56,46.16
USB_N
  Top 0.203: J5.2 35.65,36.26 34.14,34.75 32.17,34.75 U$2.6
USB_P
  Top 0.203: J5.3 35,36.83 34.21,36.04 U$2.5
VBAT
  Top 0.61: C4.1 46.29,36.87 F2.1 50.14,35.07 50.14,33.05 50.92,32.27 50.92,31.65 U$1.3 | C4.1 45.85,37 | Q2.3 21.34,7.48 21.34,11.89 24.97,15.52 28.93,15.52 30.02,16.61 30.02,23.39 30.86,24.23 41,24.23 41.91,25.15 41.91,34.75 42.98,35.81 44.81,35.81 45.85,36.86 C4.1
X1  (via drill 0.35)
  Top 0.152: C7.+ 32.18,20.14 v32.16,20.12 | Y1.1 25.31,21.78 25.3,21.79 | U$2.7 30.15,33.5 v29.41,32.77
  Top 0.203: v27.13,19.96 25.31,21.78 | v27.58,29.72 27.58,26.82 25.3,24.54 25.3,21.79
  Bottom 0.152: v32.16,20.12 32,19.96
  Bottom 0.203: 32,19.96 v27.13,19.96 | v29.41,32.77 28.04,32.77 27.58,32.31 v27.58,29.72
X2  (via drill 0.35)
  Top 0.152: C8.+ 37.72,16.61 | v23.62,17.37 23.62,18.75 24.54,19.66 25.96,19.66 Y1.3 | U$2.8 30.71,32.23 v29.72,31.24
  Top 0.203: 37.72,16.61 v35.66,16.61
  Bottom 0.203: v35.66,16.61 24.38,16.61 v23.62,17.37 22.55,18.44 22.55,24.38 23.16,24.99 28.96,24.99 29.72,25.76 v29.72,31.24

### Text on the board
tPlace: + | - | - | - | - | - | - | + | + | + | + | - | + | (-) | (+) | github.com/elvandry13 | 24V | @elvandry13 | M- | M+
bPlace: HEATSINK | MICRO SD | HEATSINK